# Altium schematic sheet mcu.SchDoc: =ProjectName+'_'+ProjectRevision+'_'+VariantName
size A3; DocumentNumber: 4; SheetNumber: 4; SheetTotal: 5
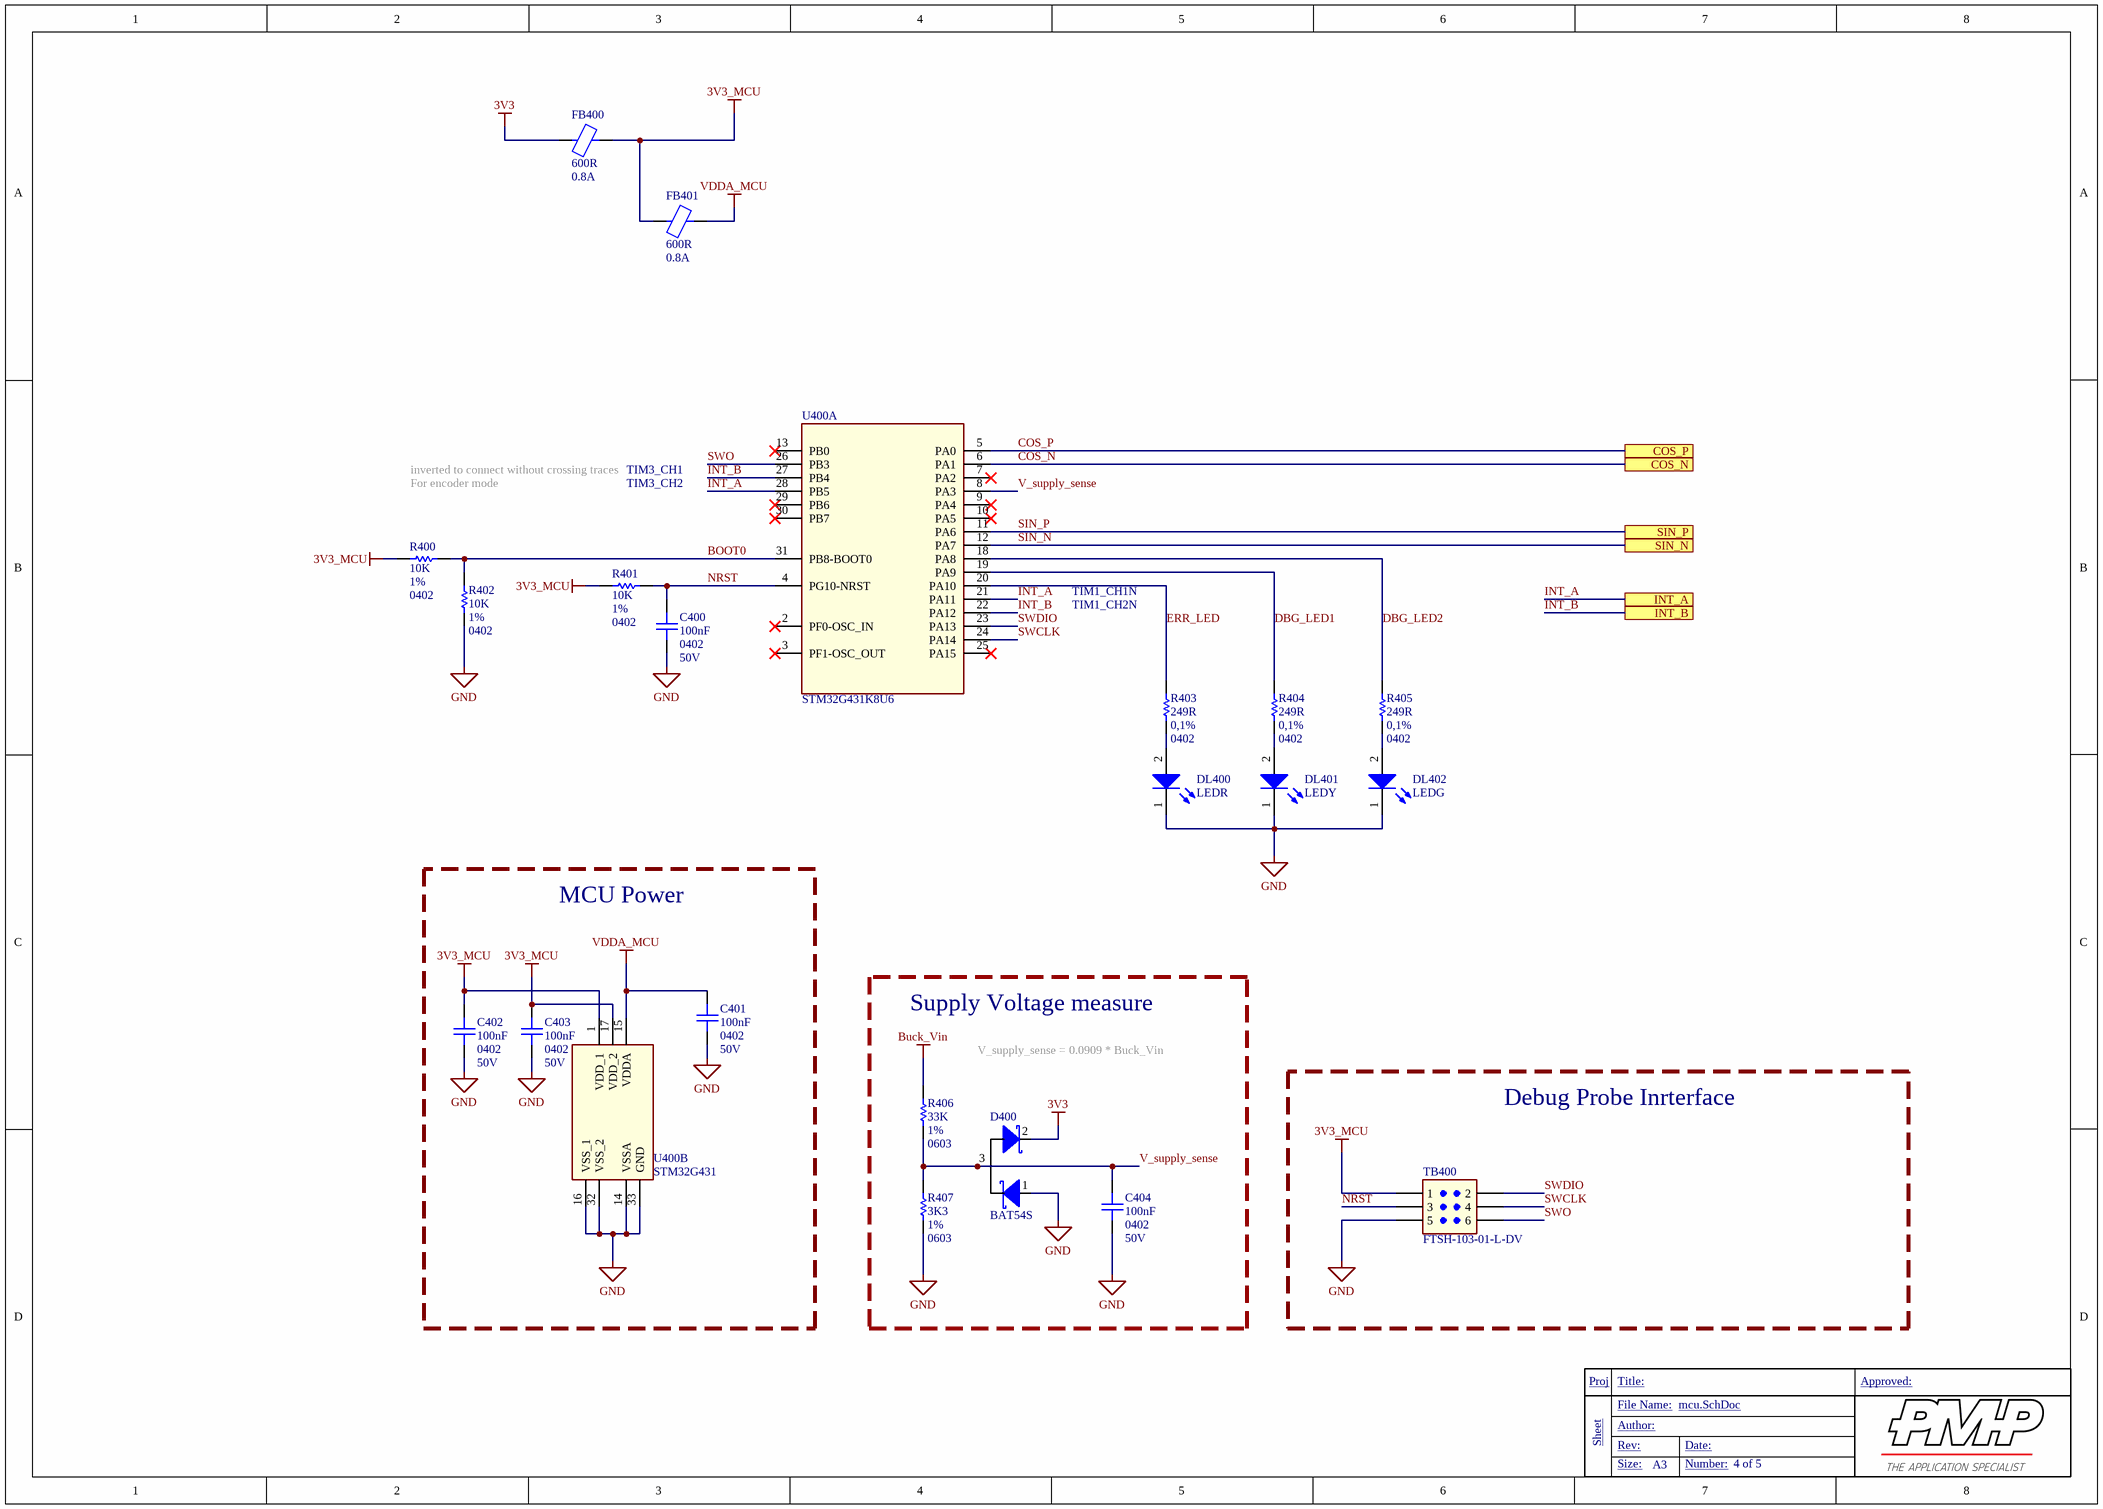
[diagram p0: mcu.SchDoc]

## Parts
C400  Case/Package: 0402  Op Voltage: 50V  [CER0402]  (hidden comment: 100nF)
C401  Case/Package: 0402  Op Voltage: 50V  [CER0402]  (hidden comment: 100nF)
C402  Case/Package: 0402  Op Voltage: 50V  [CER0402]  (hidden comment: 100nF)
C403  Case/Package: 0402  Op Voltage: 50V  [CER0402]  (hidden comment: 100nF)
C404  Case/Package: 0402  Op Voltage: 50V  [CER0402]  (hidden comment: 100nF)
D400  value BAT54S  [SOT95P230X110-3N]  (hidden comment: Double Schottky Diode, SOT23-3 series)
DL400  value LEDR  [LED SMD 0603]  (hidden comment: Single Color SMD LED)
DL401  value LEDY  [LED_PLCC-4]  (hidden comment: Single Color SMD LED)
DL402  value LEDG  [LED SMD 0603]  (hidden comment: Single Color SMD LED)
FB400  Impedence @100MHz: 600R  Rated Current @85°C: 0.8A  [FEB0603]
FB401  Impedence @100MHz: 600R  Rated Current @85°C: 0.8A  [FEB0603]
R400  value 10K  Tolerance: 1%  Case/Package: 0402  [Res0402]  (hidden comment: SMD Resistor)
R401  value 10K  Tolerance: 1%  Case/Package: 0402  [Res0402]  (hidden comment: SMD Resistor)
R402  value 10K  Tolerance: 1%  Case/Package: 0402  [Res0402]  (hidden comment: SMD Resistor)
R403  value 249R  Tolerance: 0,1%  Case/Package: 0402  [Res0402]  (hidden comment: SMD Resistor)
R404  value 249R  Tolerance: 0,1%  Case/Package: 0402  [Res0402]  (hidden comment: SMD Resistor)
R405  value 249R  Tolerance: 0,1%  Case/Package: 0402  [Res0402]  (hidden comment: SMD Resistor)
R406  value 33K  Tolerance: 1%  Case/Package: 0603  [Res0603]  (hidden comment: SMD Resistor)
R407  value 3K3  Tolerance: 1%  Case/Package: 0603  [Res0603]  (hidden comment: SMD Resistor)
TB400  value FTSH-103-01-L-DV  [SAMTEC_FTSH-103_3x2_SMD]  (hidden comment: TC2030_NL)
U400  STM32G431K8U6  [QFN50P500X500X60-NOPAD]  (parts A,B of 2)

## Blocks framed on the sheet
MCU Power: C401-C403 U400
Supply Voltage measure: C404 D400 R406 R407
Debug Probe Inrterface: TB400

## Ports
COS_N, COS_P, INT_A, INT_B, SIN_N, SIN_P

## Nets
3V3: D400.2(K2) FB400.1
3V3_MCU: C402.1 C403.1 FB400.2 FB401.1 R400.2 R401.2 TB400.1 U400.1(VDD_1) U400.17(VDD_2)
Buck_Vin: R406.2
GND: C400.2 C401.2 C402.2 C403.2 C404.2 D400.1(A1) DL400.1(K) DL401.1(K) DL402.1(K) R402.1 R407.1 TB400.5 U400.14(VSSA) U400.16(VSS_1) U400.32(VSS_2) U400.33(GND)
VDDA_MCU: C401.1 FB401.2 U400.15(VDDA)
BOOT0: R400.1 R402.2 U400.31(PB8-BOOT0)
COS_N: U400.6(PA1) ; port COS_N
COS_P: U400.5(PA0) ; port COS_P
DBG_LED1: R404.2 U400.19(PA9)
DBG_LED2: R405.2 U400.18(PA8)
ERR_LED: R403.2 U400.20(PA10)
INT_A: U400.21(PA11) U400.28(PB5) ; port INT_A
INT_B: U400.22(PA12) U400.27(PB4) ; port INT_B
NRST: C400.1 R401.1 TB400.3 U400.4(PG10-NRST)
SIN_N: U400.12(PA7) ; port SIN_N
SIN_P: U400.11(PA6) ; port SIN_P
SWCLK: TB400.4 U400.24(PA14)
SWDIO: TB400.2 U400.23(PA13)
SWO: TB400.6 U400.26(PB3)
V_supply_sense: C404.1 D400.3(C) R406.1 R407.2 U400.8(PA3)
NetDL400_2: DL400.2(A) R403.1
NetDL401_2: DL401.2(A) R404.1
NetDL402_2: DL402.2(A) R405.1

Not connected (* = marked no-connect by the designer): U400 2(PF0-OSC_IN)* 3(PF1-OSC_OUT)* 7(PA2)* 9(PA4)* 10(PA5)* 13(PB0)* 25(PA15)* 29(PB6)* 30(PB7)*

## Notes on the sheet
- inverted to connect without crossing traces
- For encoder mode
- TIM3_CH1
- TIM3_CH2
- TIM1_CH1N
- TIM1_CH2N
- V_supply_sense = 0.0909 * Buck_Vin
- Proj
- Title:
- Approved:
- Sheet
- File Name:
- Rev:
- Author:
- Date:
- Size:
- A3
- Number:

## Library data of the parts
C400-C404 = GCM155R71H104KE02D: MLCC Automotive, 100nF, 0402, 50V, 10%, X7r; MFG1: MURATA; Min Op# Temp °C: -55; Max Op# temp °C: 125; Qualification: AEC-Q200; MPN1: GCM155R71H104KE02D; Value: 100nF; MFG2: MURATA; MPN2: GCM155R71H104KE37; Tolerance: 10%; Dielectric: X7R; Supplier: Mouser; Supplier Part Number: 81-GCM155R71H104KE2D; Supplier URL: https://www.mouser.it/ProductDetail/Murata-Electronics/GCM155R71H104KE02D?qs=hNud%2FORuBR2sLZsqfoz4Fw%3D%3D; Datasheet URL: https://www.mouser.it/datasheet/2/281/1/GCM155R71H104KE02_01A-3142168.pdf; Technology: Powertrain/Safety for Automotive
D400 = BAT54S: Dual Schottky Diode,  Dual Series, SOT23, 0.2A, 30V; MFG1: NEXPERIA; If (A): 0.2; Type: Dual Series A1K2C; MPN1: BAT54S; MFG2: OnSemi; MPN2: BAT54SLT1G; Vreverse: 30V; Case/Package: SOT323-3 (SC70)
DL400 = SML-D12U8WT86C: LED standard - SMD Red 620nm 63mcd 2.2 V, 20mA, 0603 AECQ-102; MFG1: ROHM; Vf: 2V @4mA; Max Current@ Tmax: 4mA; Power Diss (mW): 54mW; Min Op# Temp °C: -40; Max Op# temp °C: 100; Qualification: AEC-Q101; MPN1: SML-D12U8WT86C; Case/Package: 0603-Top View; Color: red 620nm; Supplier: Mouser; Supplier Part Number: 755-SML-D12U8WT86C; Supplier URL: https://www.mouser.it/ProductDetail/ROHM-Semiconductor/SML-D12U8WT86C?qs=HXFqYaX1Q2wNcb%2FPJz96zg%3D%3D; Datasheet URL: https://fscdn.rohm.com/en/products/databook/datasheet/opto/led/chip_mono/sml-d12u8wt86(c)-e.pdf; Technology: SM
DL401 = LY E63F-EAGA-36-1-50-R33: LED monocolore Yellow Power TOPLED; MFG1: OSRAM; Vf: 1.85V@4mA; Max Current@ Tmax: 50mA; Min Op# Temp °C: -40; Max Op# temp °C: 100; Qualification: AEC-Q102; MPN1: LY E63F-EAGA-36-1-50-R33; Case/Package: PLCC4 3x3.4 h3.8mm; Color: Yellow 590nm; Supplier: Mouser; Supplier Part Number: 720-LYE63FA5935; Supplier URL: https://www.mouser.it/it/ProductDetail/ams-OSRAM/LY-E63F-EAGA-36-1?qs=vLWxofP3U2ym8HO6HoqADg%3D%3D; Datasheet URL: https://dammedia.osram.info/media/resource/hires/osram-dam-7071545/LY%20E63F_EN.pdf; Technology: SM
DL402 = SML-D12P8WT86C: LED standard - SMD Grn 560nm 6.3mcd 2.2 V, 20mA, 0603 AECQ-102; MFG1: ROHM; Vf: 2V @4mA; Max Current@ Tmax: 4mA; Power Diss (mW): 54mW; Min Op# Temp °C: -40; Max Op# temp °C: 100; Qualification: AEC-Q101; MPN1: SML-D12P8WT86C; Case/Package: 0603-Top View; Color: Green 560nm; Supplier: Mouser; Supplier Part Number: 755-SML-D12P8WT86C; Supplier URL: https://www.mouser.it/ProductDetail/ROHM-Semiconductor/SML-D12P8WT86C?qs=HXFqYaX1Q2wFepzn1zWRrg%3D%3D; Datasheet URL: https://fscdn.rohm.com/en/products/databook/datasheet/opto/led/chip_mono/sml-d12p8wt86(c)-e.pdf; Technology: SM
FB400 FB401 = BLM18HE601SH1D: SMD EMI Suppression Ferrite Bead 600R, 0603, For DC Power; MFG1: MURATA; Rated Current @125°C: 0.6A; DCR (mR): 125; Min Op# Temp °C: -55; MPN1: BLM18HE601SH1D; Impedence @1GHz: 600R; Case/Package: 0603; Supplier: Mouser; Supplier Part Number: 81-BLM18HE601SH1D; Supplier URL: https://www.mouser.it/ProductDetail/Murata-Electronics/BLM18HE601SH1D?qs=d0WKAl%252BL4KZJDOgHon8ecQ%3D%3D; Datasheet URL: https://www.murata.com/products/productdata/8796199452702/QNFA9104.pdf?1539737628000; Max Op# temp °C: 125; Technology: AEC-Q200
R400-R402 = CRCW040210K0FKED: Thick Film SM Chip Resistors, 10K, 0402, ±1%, 1/10W; MFG1: VISHAY; Power: 63mW; Temp# Coeffiient (PPM/C): 100; Min Op# Temp °C: -55; Max Op# temp °C: 155; Qualification: AEC-Q200; MPN1: CRCW040210K0FKED; Supplier: Mouser; Supplier Part Number: 71-CRCW0402-10K-E3; Supplier URL: https://www.mouser.it/ProductDetail/Vishay-Dale/CRCW040210K0FKED?qs=rlE3Te1NifyN3e8vvxacSw%3D%3D; Technology: Thick Film
R403-R405 = TNPW0402249RBYEP: Thick Film SM Chip Resistors, 249R, 0402, ±0.1%, 10ppm 1/16W; MFG1: VISHAY; Power: 63mW; Temp# Coeffiient (PPM/C): 10; Min Op# Temp °C: -55; Max Op# temp °C: 155; Qualification: AEC-Q200; MPN1: TNPW0402249RBYEP; Supplier: Mouser; Supplier Part Number: 71-TNPW0402249RBYEP; Supplier URL: https://www.mouser.it/ProductDetail/Vishay-Dale/TNPW0402249RBYEP?qs=iLbezkQI%252Bsgmf6IA3nvojA%3D%3D; Technology: Thick Film
R406 = CRCW060333K0FKEA: Thick Film SM Chip Resistors, 33K, 0603, ±1%, 1/10W; MFG1: VISHAY; Power: 100mW; Temp# Coeffiient (PPM/C): 100; Min Op# Temp °C: -55; Max Op# temp °C: 155; Qualification: AEC-Q200; MPN1: CRCW060333K0FKEA; Supplier: Mouser; Supplier Part Number: 71-CRCW0603-33K-E3; Supplier URL: https://www.mouser.it/ProductDetail/Vishay-Dale/CRCW060333K0FKEA?qs=lRdAfIXKPc%2FlOd6gcmC8oQ%3D%3D; Technology: Thick Film
R407 = CRCW06033K30FKEA: Thick Film SM Chip Resistors, 3K3, 0603, ±1%, 1/10W; MFG1: VISHAY; Power: 100mW; Temp# Coeffiient (PPM/C): 100; Min Op# Temp °C: -55; Max Op# temp °C: 155; Qualification: AEC-Q200; MPN1: CRCW06033K30FKEA; Supplier: Mouser; Supplier Part Number: 71-CRCW0603-3.3K-E3; Supplier URL: https://www.mouser.it/ProductDetail/Vishay-Dale/CRCW06033K30FKEA?qs=1ghF3ZI8kS8fRqapjAj84Q%3D%3D&gad_source=1&gclid=EAIaIQobChMI4J_M0IWohAMVrUNBAh1qNACkEAAYBCAAEgIV-vD_BwE; Technology: Thick Film
TB400 = FTSH-103-01-L-DV: Samtech FTSH Header, 6pin (3x2), pitch 1.27mm, for Arm Jtag; MFG1: Samtec; Pitch: 1.27; Min Op# Temp °C: -55; Max Op# temp °C: 125; MPN1: FTSH-103-01-L-DV; Pins: 6; Case/Package: SMD-6; Orientation: Vertical; Mount: SMD; Supplier: Mouser; Supplier Part Number: 200-FTSH10301LDV; Supplier URL: https://www.mouser.it/it/ProductDetail/Samtec/FTSH-103-01-L-DV?qs=WqbWUrltBn0517uOVN%2FZKw%3D%3D; Datasheet URL: https://www.mouser.it/datasheet/3/85/1/ftsh_smt.pdf
U400 = STM32G431K8U6: MCU  Arm Cortex-M4 MCU 170 MHz -64 KB Flash; Manufacturer_Name: STMicroelectronics; Geometry.Height: 0.6mm; Mouser Part Number: 511-STM32G431K8U6; Mouser Price/Stock: https://www.mouser.co.uk/ProductDetail/STMicroelectronics/STM32G431K8U6?qs=sPbYRqrBIVmxpguskjGNNg%3D%3D; Manufacturer_Part_Number: STM32G431K8U6; Datasheet Link: https://www.st.com/resource/en/datasheet/stm32g431c6.pdf; MPN1: STM32G431K8U6; Value: STM32G431; MFG1: STMicroelectronics; Case/Package: QFN32